# Altium schematic sheet Sheet1.SchDoc
size A
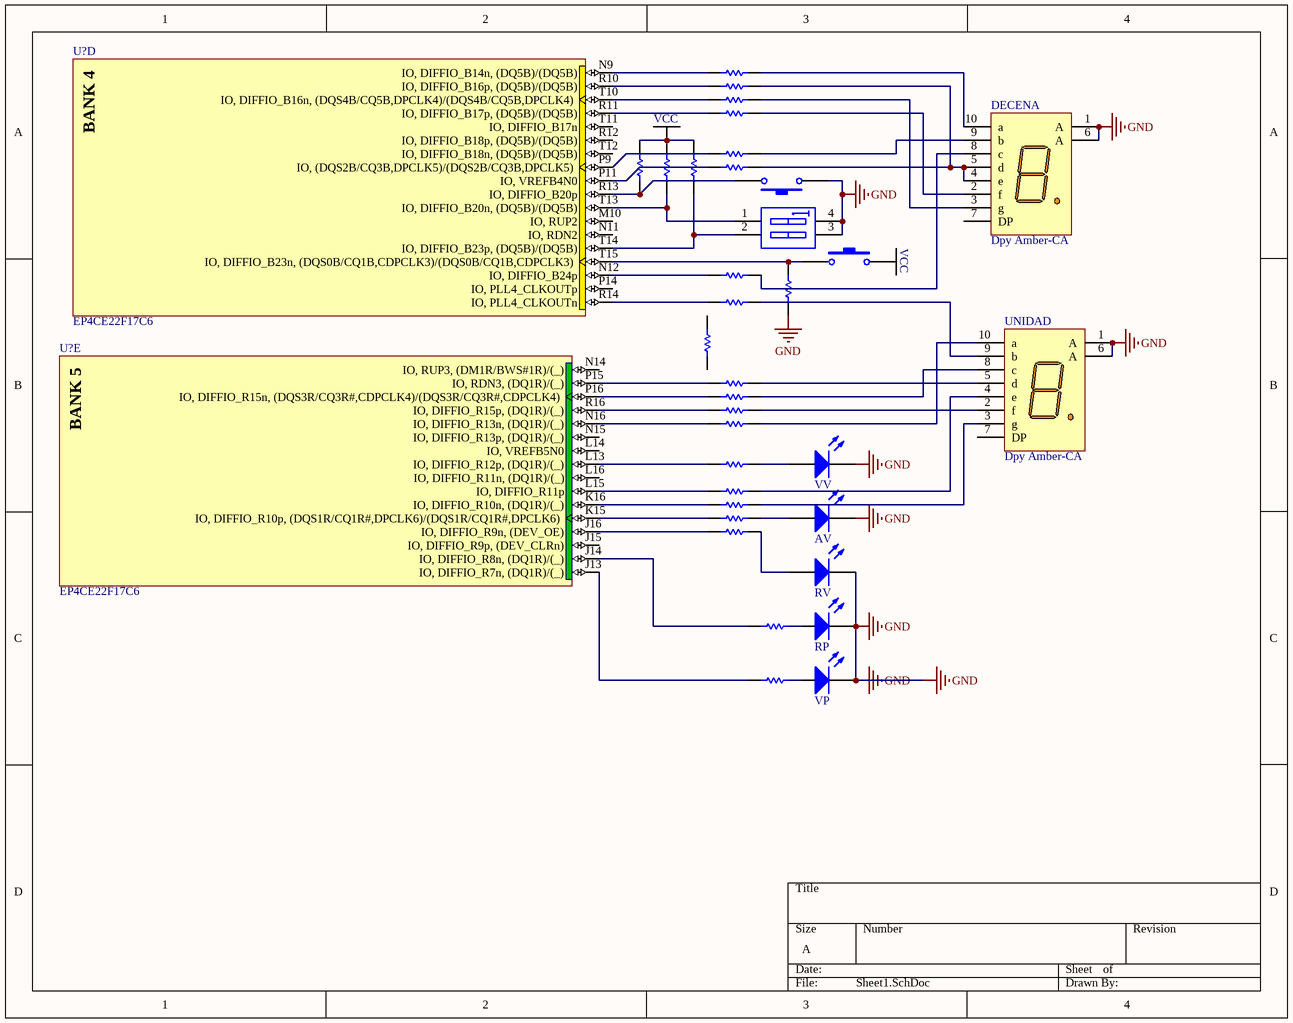
[diagram p0: Sheet1.SchDoc]

## Parts
(Parts that share a designator on the sheet are numbered #1, #2 ... from top to bottom, then left to right.)
?#1  Res1  [AXIAL-0.3]  (value not drawn)
?#2  Res1  [AXIAL-0.3]  (value not drawn)
?#3  Res1  [AXIAL-0.3]  (value not drawn)
?#4  Res1  [AXIAL-0.3]  (value not drawn)
?#5  Res1  [AXIAL-0.3]  (value not drawn)
?#6  Res1  [AXIAL-0.3]  (value not drawn)
?#7  Res1  [AXIAL-0.3]  (value not drawn)
?#8  Res1  [AXIAL-0.3]  (value not drawn)
?#9  Res1  [AXIAL-0.3]  (value not drawn)
?#10  Res1  [AXIAL-0.3]  (value not drawn)
?#11  Res1  [AXIAL-0.3]  (value not drawn)
?#12  Res1  [AXIAL-0.3]  (value not drawn)
?#13  Res1  [AXIAL-0.3]  (value not drawn)
?#14  Res1  [AXIAL-0.3]  (value not drawn)
?#15  Res1  [AXIAL-0.3]  (value not drawn)
?#16  Res1  [AXIAL-0.3]  (value not drawn)
?#17  Res1  [AXIAL-0.3]  (value not drawn)
?#18  Res1  [AXIAL-0.3]  (value not drawn)
?#19  Res1  [AXIAL-0.3]  (value not drawn)
?#20  Res1  [AXIAL-0.3]  (value not drawn)
?#21  Res1  [AXIAL-0.3]  (value not drawn)
?#22  Res1  [AXIAL-0.3]  (value not drawn)
?#23  Res1  [AXIAL-0.3]  (value not drawn)
?#24  Res1  [AXIAL-0.3]  (value not drawn)
D?#1  VV  [LED-0]
D?#2  AV  [LED-0]
D?#3  RV  [LED-0]
D?#4  RP  [LED-0]
D?#5  VP  [LED-0]
DECENA  Dpy Amber-CA  [A]
S?#1  SW-PB  [SPST-2]  (value not drawn)
S?#2  SW DIP-2  [DIP-4]  (value not drawn)
S?#3  SW-PB  [SPST-2]  (value not drawn)
U?#1  EP4CE22F17C6  [FBGA256_A-155]  (part D of 13)
U?#2  EP4CE22F17C6  [FBGA256_A-155]  (part E of 13)
UNIDAD  Dpy Amber-CA  [A]

## Nets
GND: ?#11.2 D?#1.2(K) D?#2.2(K) D?#3.2(K) D?#4.2(K) D?#5.2(K) DECENA.1(A) DECENA.6(A) S?#1.1 S?#2.3(B2) S?#2.4(B1) UNIDAD.1(A) UNIDAD.6(A)
Net?#1_1: ?#1.1 U?#1.N9(IO,_DIFFIO_B14n,_(DQ5B)/(DQ5B))
Net?#1_2: ?#1.2 DECENA.10(a)
Net?#2_1: ?#2.1 U?#1.R10(IO,_DIFFIO_B16p,_(DQ5B)/(DQ5B))
Net?#2_2: ?#2.2 ?#9.2 DECENA.4(e) DECENA.5(d)
Net?#3_1: ?#3.1 U?#1.T10(IO,_DIFFIO_B16n,_(DQS4B/CQ5B,DPCLK4)/(DQS4B/CQ5B,DPCLK4))
Net?#3_2: ?#3.2 DECENA.3(g)
Net?#4_1: ?#4.1 U?#1.R11(IO,_DIFFIO_B17p,_(DQ5B)/(DQ5B))
Net?#4_2: ?#4.2 DECENA.2(f)
Net?#5_1: ?#5.1 U?#1.P9(IO,_(DQS2B/CQ3B,DPCLK5)/(DQS2B/CQ3B,DPCLK5))
Net?#5_2: ?#5.2 DECENA.9(b)
Net?#6_1: ?#6.1 ?#7.1 ?#8.1
Net?#6_2: ?#6.2 S?#1.2 U?#1.R13(IO,_DIFFIO_B20p)
Net?#7_2: ?#7.2 S?#2.1(A1) U?#1.T13(IO,_DIFFIO_B20n,_(DQ5B)/(DQ5B))
Net?#8_2: ?#8.2 S?#2.2(A2) U?#1.T14(IO,_DIFFIO_B23p,_(DQ5B)/(DQ5B))
Net?#9_1: ?#9.1 U?#1.P11(IO,_VREFB4N0)
Net?#10_1: ?#10.1 U?#1.N12(IO,_DIFFIO_B24p)
Net?#10_2: ?#10.2 DECENA.8(c)
Net?#11_1: ?#11.1 S?#3.1 U?#1.T15(IO,_DIFFIO_B23n,_(DQS0B/CQ1B,CDPCLK3)/(DQS0B/CQ1B,CDPCLK3))
Net?#12_1: ?#12.1 U?#1.R14(IO,_PLL4_CLKOUTn)
Net?#12_2: ?#12.2 UNIDAD.9(b)
Net?#14_1: ?#14.1 U?#2.P15(IO,_RDN3,_(DQ1R)/(_))
Net?#14_2: ?#14.2 UNIDAD.5(d)
Net?#15_1: ?#15.1 U?#2.P16(IO,_DIFFIO_R15n,_(DQS3R/CQ3R#,CDPCLK4)/(DQS3R/CQ3R#,CDPCLK4))
Net?#15_2: ?#15.2 UNIDAD.8(c)
Net?#16_1: ?#16.1 U?#2.R16(IO,_DIFFIO_R15p,_(DQ1R)/(_))
Net?#16_2: ?#16.2 UNIDAD.2(f)
Net?#17_1: ?#17.1 U?#2.N16(IO,_DIFFIO_R13n,_(DQ1R)/(_))
Net?#17_2: ?#17.2 UNIDAD.10(a)
Net?#18_1: ?#18.1 U?#2.L13(IO,_DIFFIO_R12p,_(DQ1R)/(_))
Net?#18_2: ?#18.2 D?#1.1(A)
Net?#19_1: ?#19.1 U?#2.L15(IO,_DIFFIO_R11p)
Net?#19_2: ?#19.2 UNIDAD.4(e)
Net?#20_1: ?#20.1 U?#2.K16(IO,_DIFFIO_R10n,_(DQ1R)/(_))
Net?#20_2: ?#20.2 UNIDAD.3(g)
Net?#21_1: ?#21.1 U?#2.K15(IO,_DIFFIO_R10p,_(DQS1R/CQ1R#,DPCLK6)/(DQS1R/CQ1R#,DPCLK6))
Net?#21_2: ?#21.2 D?#2.1(A)
Net?#22_1: ?#22.1 U?#2.J16(IO,_DIFFIO_R9n,_(DEV_OE))
Net?#22_2: ?#22.2 D?#3.1(A)
Net?#23_1: ?#23.1 U?#2.J14(IO,_DIFFIO_R8n,_(DQ1R)/(_))
Net?#23_2: ?#23.2 D?#4.1(A)
Net?#24_1: ?#24.1 U?#2.J13(IO,_DIFFIO_R7n,_(DQ1R)/(_))
Net?#24_2: ?#24.2 D?#5.1(A)

Not connected (* = marked no-connect by the designer): ?#13 1 2; DECENA 7(DP); S?#3 2; U?#1 M10(IO,_RUP2) N11(IO,_RDN2) P14(IO,_PLL4_CLKOUTp) R12(IO,_DIFFIO_B18p,_(DQ5B)/(DQ5B)) T11(IO,_DIFFIO_B17n) T12(IO,_DIFFIO_B18n,_(DQ5B)/(DQ5B)); U?#2 J15(IO,_DIFFIO_R9p,_(DEV_CLRn)) L14(IO,_VREFB5N0) L16(IO,_DIFFIO_R11n,_(DQ1R)/(_)) N14(IO,_RUP3,_(DM1R/BWS#1R)/(_)) N15(IO,_DIFFIO_R13p,_(DQ1R)/(_)); UNIDAD 7(DP)

## Notes on the sheet
- (near ?#7) VCC
- (near S?#3) VCC
- (in symbol EP4CE22F17C6, part D) BANK 4
- (in symbol EP4CE22F17C6, part E) BANK 5

## Library data of the parts
?#1-?#24 = Res1: Resistor; Value: 330; Published: 8-Jun-2000; LatestRevisionDate: 17-Jul-2002; LatestRevisionNote: Re-released for DXP Platform.; PackageReference: AXIAL-0.3; Publisher: Altium Limited; PackageDescription: Axial Device, Thru-Hole; 2 Leads; 0.3 in Pin Spacing
D?#1-D?#5 = LED0: Typical INFRARED GaAs LED; Published: 8-Jun-2000; LatestRevisionDate: 08-Jul-2005; LatestRevisionNote: Mech Layer 1 removed.; PackageReference: LED-0; Publisher: Altium Limited; PackageDescription: LED; 2 Leads
DECENA UNIDAD = Dpy Amber-CA: 7.62 mm Black Surface Orange 7-Segment Display: CA, RH DP; MinimumIntensity: 354 ucd; Note: IF = 5 mA; Note: Pins 1 and 6 are redundant Anodes.; Published: 8-Jun-2000; LatestRevisionDate: 17-Dec-2003; LatestRevisionNote: Schematic revised, PCB Footprint replaced.; DatasheetVersion: 19-Feb-2002; PackageVersion: 11-Feb-2002; PackageReference: A; Publisher: Altium Limited; PackageDescription: LED, 7-Segment Display, 7.62 mm, RHD; 10 Leads; Row Space 5.08 mm; Pitch 2.54 mm; Colour: Orange; ComponentLink1Description: Manufacturer Link; ComponentLink1URL: http://www.agilent.com/
S?#1 S?#3 = SW-PB: Switch; Published: 24-Mar-1999; LatestRevisionDate: 17-Jul-2002; LatestRevisionNote: Re-released for DXP Platform.; PackageReference: SPST-2; Publisher: Altium Limited; PackageDescription: Switch; 2 Leads
S?#2 = SW DIP-2: DIP Switch, 2 Position, SPST; Published: 24-Mar-1999; LatestRevisionDate: 17-Jul-2002; LatestRevisionNote: Re-released for DXP Platform.; PackageReference: DIP-4; Publisher: Altium Limited
U?#1 U?#2 = EP4CE22F17C6: Cyclone IV Family FPGA, 1.2V Core, 153 I/O Pins, 4 PLLs, 256-Pin FBGA, Speed Grade 6, Commercial Grade; Manufacturer: Altera; DatasheetVersion: ver1.6, Nov-2011; PackageVersion: ver2.0, Nov-2011; PackageReference: FBGA256_A-155; PackageDescription: 256-Pin FineLine Ball-Grid Array (FBGA) - Thin - Wire Bond - A:1.55; Code_JEDEC: MO-192-DAF-1; ComponentLink1Description: Manufacturer URL; ComponentLink1URL: http://www.altera.com/; ComponentLink2Description: Handbook; ComponentLink2URL: http://www.altera.com/literature/hb/cyclone-iv/cyclone4-handbook.pdf; ComponentLink3Description: Pinout; ComponentLink3URL: http://www.altera.com/literature/lit-dp.jsp?category=cyc%204&showspreadsheet=y; ComponentLink4Description: Package Specification; ComponentLink4URL: http://www.altera.com/devicepackaging/04R00230-03.pdf